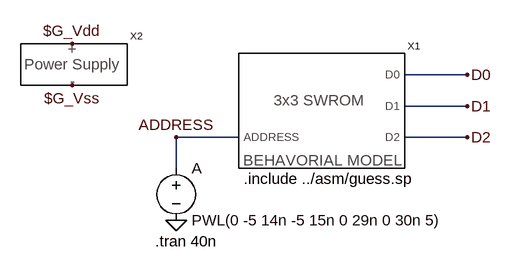
[diagram p0: schematic swrom-fast_test.asc]
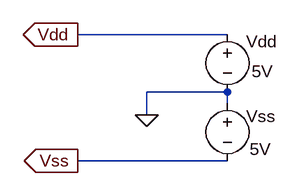
[diagram p1: sub-circuit tpower.asc]
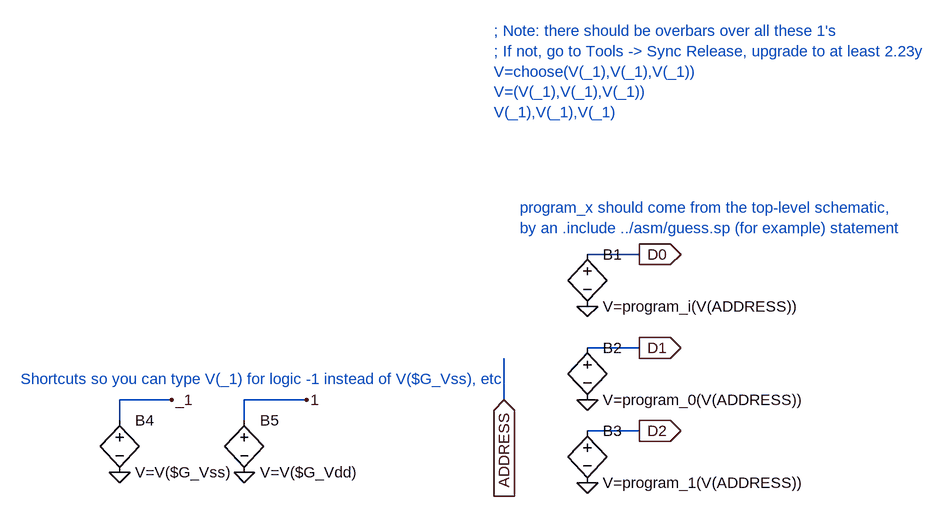
[diagram p2: sub-circuit swrom-fast.asc]
swrom-fast_test.asc, the LTspice schematic file:
Version 4
SHEET 1 880 680
WIRE 416 80 320 80
WIRE 416 128 320 128
WIRE 64 176 -32 176
WIRE 416 176 320 176
WIRE -32 224 -32 176
FLAG 416 80 D0
FLAG 416 128 D1
FLAG 416 176 D2
FLAG -32 304 0
FLAG -192 32 $G_Vdd
FLAG -192 96 $G_Vss
FLAG -32 176 ADDRESS
SYMBOL voltage -32 208 R0
SYMATTR InstName A
SYMATTR Value PWL(0 -5 14n -5 15n 0 29n 0 30n 5)
SYMBOL tpower -192 64 R0
SYMATTR InstName X2
SYMBOL swrom-fast 112 80 R0
WINDOW 39 0 0 Left 0
SYMATTR InstName X1
TEXT -64 336 Left 0 !.tran 40n
TEXT 72 240 Left 0 !.include ../asm/guess.sp

tpower.asc, the sub-circuit schematic file:
Version 4
SHEET 1 880 680
WIRE -112 32 -320 32
WIRE -112 112 -224 112
WIRE -112 128 -112 112
WIRE -224 144 -224 112
WIRE -112 208 -320 208
FLAG -224 144 0
FLAG -320 32 Vdd
IOPIN -320 32 Out
FLAG -320 208 Vss
IOPIN -320 208 Out
SYMBOL voltage -112 16 R0
WINDOW 0 26 26 Left 0
WINDOW 3 34 68 Left 0
SYMATTR InstName Vdd
SYMATTR Value 5V
SYMBOL voltage -112 112 R0
WINDOW 0 26 34 Left 0
WINDOW 3 31 80 Left 0
SYMATTR InstName Vss
SYMATTR Value 5V

swrom-fast.asc, the sub-circuit schematic file:
Version 4
SHEET 1 880 720
WIRE 176 64 96 64
WIRE 176 208 96 208
WIRE -544 288 -624 288
WIRE -336 288 -432 288
WIRE -32 288 -32 224
WIRE -624 320 -624 288
WIRE -432 320 -432 288
WIRE 176 336 96 336
FLAG 176 64 D0
IOPIN 176 64 Out
FLAG 176 208 D1
IOPIN 176 208 Out
FLAG 176 336 D2
IOPIN 176 336 Out
FLAG -32 288 ADDRESS
IOPIN -32 288 In
FLAG 96 144 0
FLAG 96 288 0
FLAG 96 416 0
FLAG -624 400 0
FLAG -544 288 _1
FLAG -432 400 0
FLAG -336 288 1
SYMBOL bv 96 48 R0
SYMATTR InstName B1
SYMATTR Value V=program_i(V(ADDRESS))
SYMBOL bv 96 192 R0
SYMATTR InstName B2
SYMATTR Value V=program_0(V(ADDRESS))
SYMBOL bv 96 320 R0
SYMATTR InstName B3
SYMATTR Value V=program_1(V(ADDRESS))
SYMBOL bv -624 304 R0
SYMATTR InstName B4
SYMATTR Value V=V($G_Vss)
SYMBOL bv -432 304 R0
SYMATTR InstName B5
SYMATTR Value V=V($G_Vdd)
TEXT -776 256 Left 0 ;Shortcuts so you can type V(_1) for logic -1 instead of V($G_Vss), etc.
TEXT -48 -280 Left 0 ;; Note: there should be overbars over all these 1's\n; If not, go to Tools -> Sync Release, upgrade to at least 2.23y\nV=choose(V(_1),V(_1),V(_1))\nV=(V(_1),V(_1),V(_1))\nV(_1),V(_1),V(_1)
TEXT -8 -8 Left 0 ;program_x should come from the top-level schematic,\nby an .include ../asm/guess.sp (for example) statement

The netlist it stands for:
* swrom-fast_test.asc
V§A ADDRESS 0 PWL(0 -5 14n -5 15n 0 29n 0 30n 5)
XX2 $G_Vdd $G_Vss tpower
XX1 ADDRESS D0 D1 D2 swrom-fast

* block symbol definitions
.subckt tpower Vdd Vss
Vdd Vdd 0 5V
Vss 0 Vss 5V
.ends tpower

.subckt swrom-fast ADDRESS D0 D1 D2
B1 D0 0 V=program_i(V(ADDRESS))
B2 D1 0 V=program_0(V(ADDRESS))
B3 D2 0 V=program_1(V(ADDRESS))
B4 _1 0 V=V($G_Vss)
B5 1 0 V=V($G_Vdd)
* Shortcuts so you can type V(_1) for logic -1 instead of V($G_Vss), etc.
* ; Note: there should be overbars over all these 1's
* ; If not, go to Tools -> Sync Release, upgrade to at least 2.23y
* V=choose(V(_1),V(_1),V(_1))
* V=(V(_1),V(_1),V(_1))
* V(_1),V(_1),V(_1)
* program_x should come from the top-level schematic,
* by an .include ../asm/guess.sp (for example) statement
.ends swrom-fast

.tran 40n
.include ../asm/guess.sp
.backanno
.end